# EAGLE design panstamp-ld-relay-antcenter (EAGLE 9.0.0)
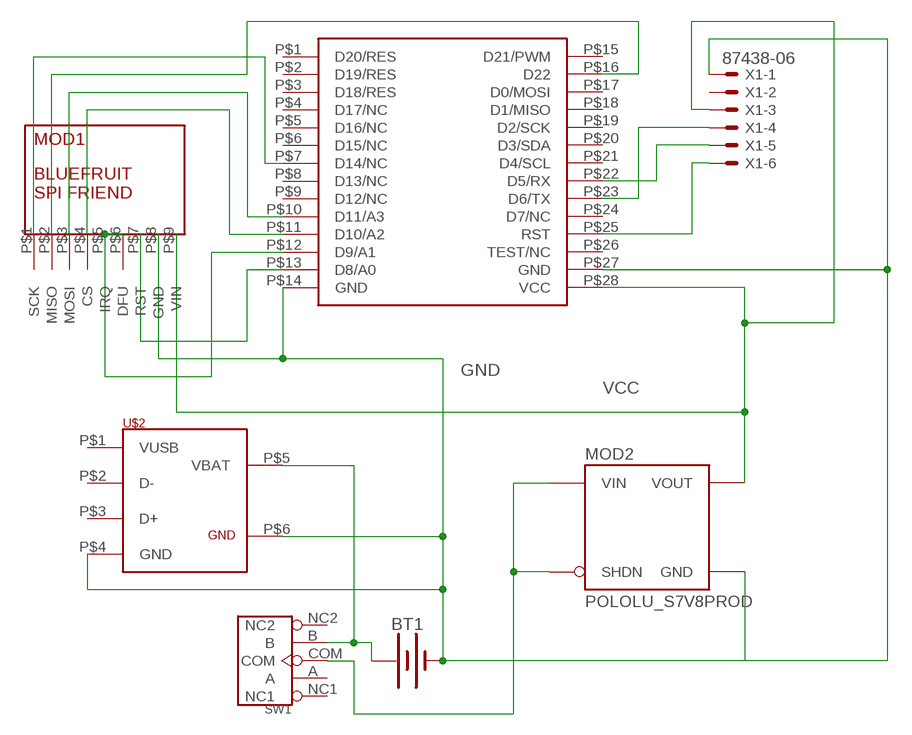
[diagram p0: schematic, sheet 1]

## Parts
BT1  BATTERY-18650  [BATTERY_18650-HOLDER]
MOD1  BLUEFRUIT-SPI  [BLUEFRUIT-SPI]
MOD2  POLOLU_S7V8PROD  [POLOLU_4P_SIGO]
SW1  DIP-TOGGLE-SWITCH-ON-ON(3+2P-8.8X4.6MM)-90D  [SW5-2.0-8.8X4.4X4.7MM-90D]
U$1  PANSTAMP-LD  [PANSTAMP-LD]
U$2  JS-1965  [JS-1965]
X1  87438-06  [87438-06]

## Nets
GND: BT1.GND@1(-) MOD1.P$8(GND) MOD2.G(GND) U$1.P$14(GND) U$1.P$27(GND) U$2.P$4(GND) U$2.P$6(GND) X1.1
N$1: U$1.P$23(D6/TX) X1.4
N$2: MOD1.P$2(MISO) U$1.P$16(D22)
N$3: MOD1.P$4(CS) U$1.P$11(D10/A2)
N$4: MOD1.P$3(MOSI) U$1.P$10(D11/A3)
N$5: MOD1.P$7(RST) U$1.P$13(D8/A0)
N$6: MOD1.P$1(SCK) U$1.P$7(D14/NC)
N$7: MOD2.I(VIN) MOD2.S(SHDN) SW1.COM
N$8: MOD1.P$5(IRQ) U$1.P$12(D9/A1)
N$9: U$1.P$22(D5/RX) X1.5
N$10: U$1.P$25(RST) X1.6
VBAT: BT1.PWR@1(+) SW1.B U$2.P$5(VBAT)
VCC: MOD1.P$9(VIN) MOD2.O(VOUT) U$1.P$28(VCC) X1.3
Unconnected: MOD1.P$6(DFU) SW1.A SW1.NC1 SW1.NC2 U$1.P$1(D20/RES) U$1.P$2(D19/RES) U$1.P$3(D18/RES) U$1.P$4(D17/NC) U$1.P$5(D16/NC) U$1.P$6(D15/NC) U$1.P$8(D13/NC) U$1.P$9(D12/NC) U$1.P$15(D21/PWM) U$1.P$17(D0/MOSI) U$1.P$18(D1/MISO) U$1.P$19(D2/SCK) U$1.P$20(D3/SDA) U$1.P$21(D4/SCL) U$1.P$24(D7/NC) U$1.P$26(TEST/NC) U$2.P$1(VUSB) U$2.P$2(D-) U$2.P$3(D+) X1.2

## Library data of the parts
BT1 = SparkFun-Batteries:BATTERY: Battery - Single Cell A variety of battery chemistries, sizes, and footprints. Device List: 20MM_PTH - Coin Cell Battery Holder - 20mm (PTH) <https://www.sparkfun.com/products/783> 6.8MM_PTH - Coin Cell Battery Holder - 6.8MM(SMD) <https://www.digikey.com/product-detail/en/seiko-instruments/MS621FE-FL11E/728-1057-ND/1889208?WT.srch=1&gclid=CNOQ5a6LzdQCFZS2wAodXCkE0g> 12MM_SMD - Coin Cell Battery Holder - 12mm (SMD) <https://www.sparkfun.com/products/10592> 12MM_PTH - Coin Cell Battery Holder - 12mm (PTH) <https://www.sparkfun.com/products/7948> 20MM_SMD - 20mm Coin Cell Battery Holder (SMD) (2 legs) Used on the Big Time Watch Kit <https://www.sparkfun.com/products/11734> 20MM_SMD_4LEGS - Coin Cell Battery Holder - 20mm (SMD) <https://www.sparkfun.com/products/11892> 20MM_SMD_4LEGS_OVERPASTE - Coin Cell Battery Holder - 20mm (SMD) <https://www.sparkfun.com/products/11892> (Over-paste on the legs) 24.5MM_PTH - Coin Cell Battery Holder - 24.5mm (PTH) <https://www.sparkfun.com/products/8863> 9V - 9V Battery Holder - PC Mount Used on the SparkFun SparkPunk Sound Kit <https://www.sparkfun.com/products/11177> and SparkFun SparkPunk Sequencer Kit <https://www.sparkfun.com/products/12707> 18650 - Battery Holder - 18650 (PTH) <https://www.sparkfun.com/products/13113> AA - Battery Holder - 1xAA (PTH) <https://www.sparkfun.com/products/7949> AAA - Battery Holder - 1xAAA (PTH) <https://www.sparkfun.com/products/12718> AA_KIT - Battery Holder - 1xAA (PTH) <https://www.sparkfun.com/products/7949> Special kit package - pads only have exposed copper on one side of the board. AAA_KIT - Battery Holder - 1xAAA (PTH) <https://www.sparkfun.com/products/12718> Special kit package - pads only have exposed copper on one side of the board.; PROD_ID: BATT-12327; SF_SKU: PRT-13113
MOD1 = relay-components:BLUEFRUIT-SPI
MOD2 = relay-components:POLOLU_S7V8: Pololu Adjustable Step Up/Down Voltage Regulators REG09B 0.4"x0.6" SOURCE www.pololu.com/ PACKAGE THT; 4-pin (0.1"); 0.4"x0.6"
SW1 = Seeed-Switch:DIP-TOGGLE-SWITCH-ON-ON(3+2P-8.8X4.6MM)-90D: 311030008; MPN: 3P-2.0-90D3P-2.0-90D-REINFORCE
U$1 = relay-components:PANSTAMP-LD: Panstamp Long Distance Board
U$2 = relay-components:JS-1965: Jaycon JS-1965 Lipo Charger with the MCP73831 charger chip.
X1 = Components:87438-06: Wire-to-Board 1.50mm (.059") Pitch Header - Right Angle, SMT, Shrouded Source: http://www.molex.com/product/micro/87438.html; MPN: 87438-0643; OC_FARNELL: 1756938; OC_NEWARK: 88K3155

## Board
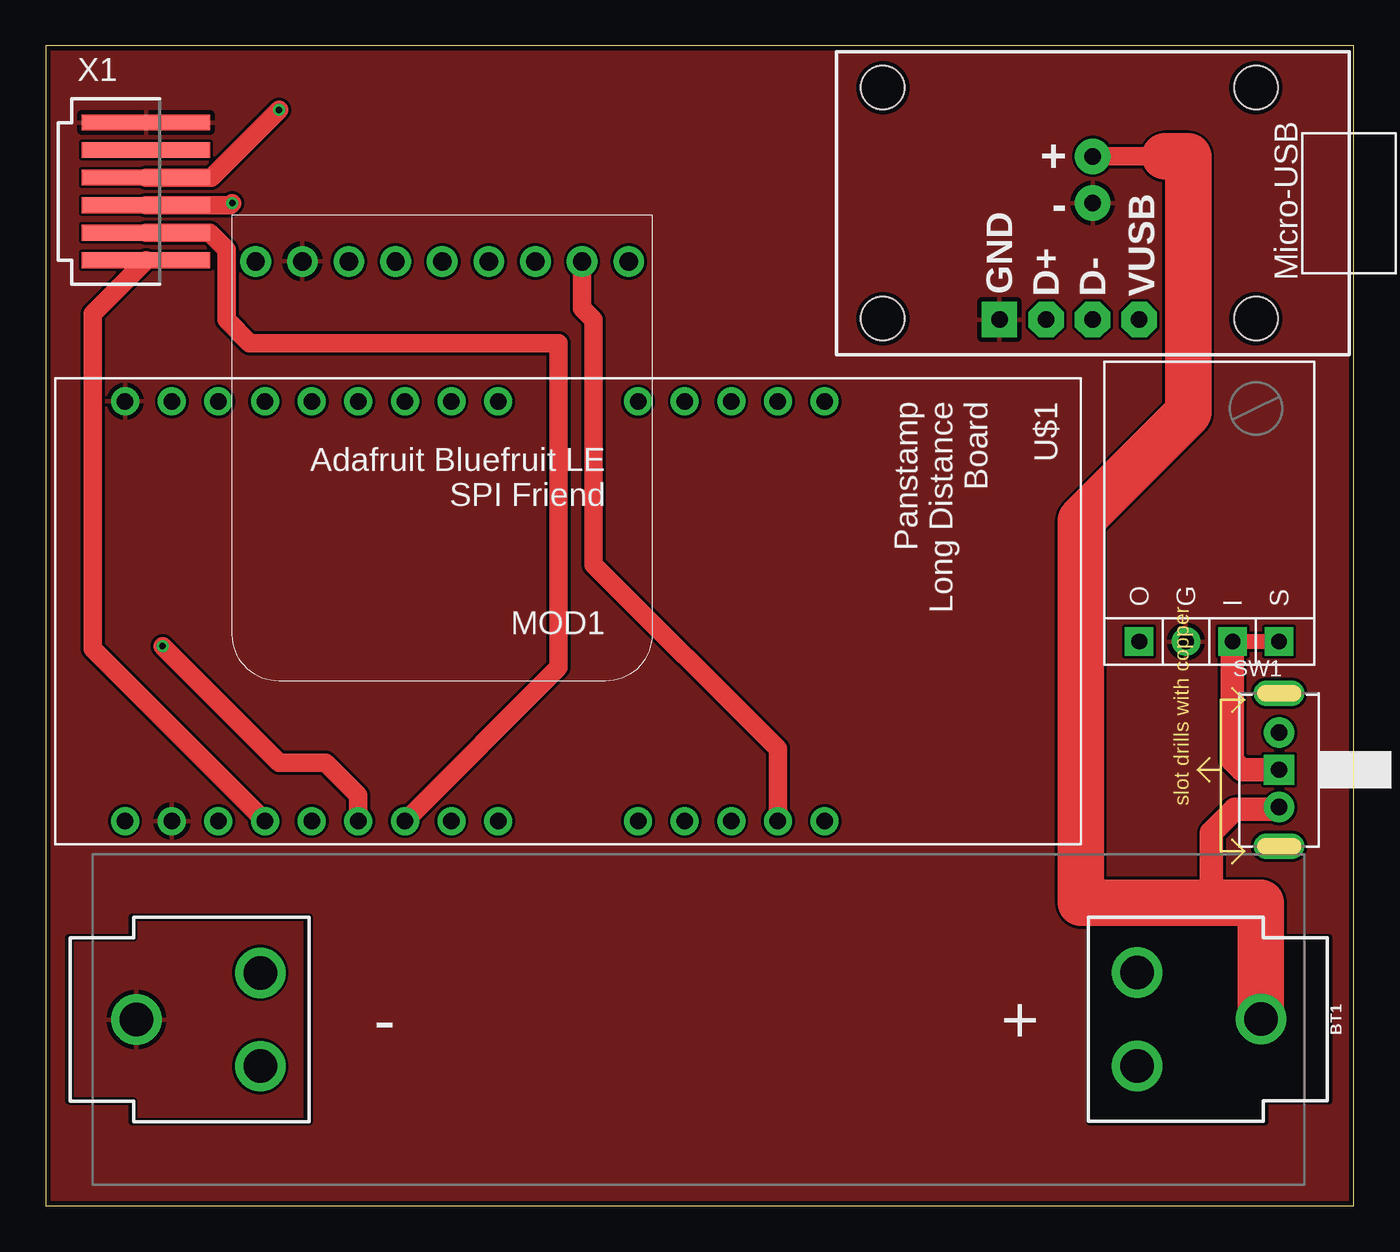
[diagram p1: board, top side]
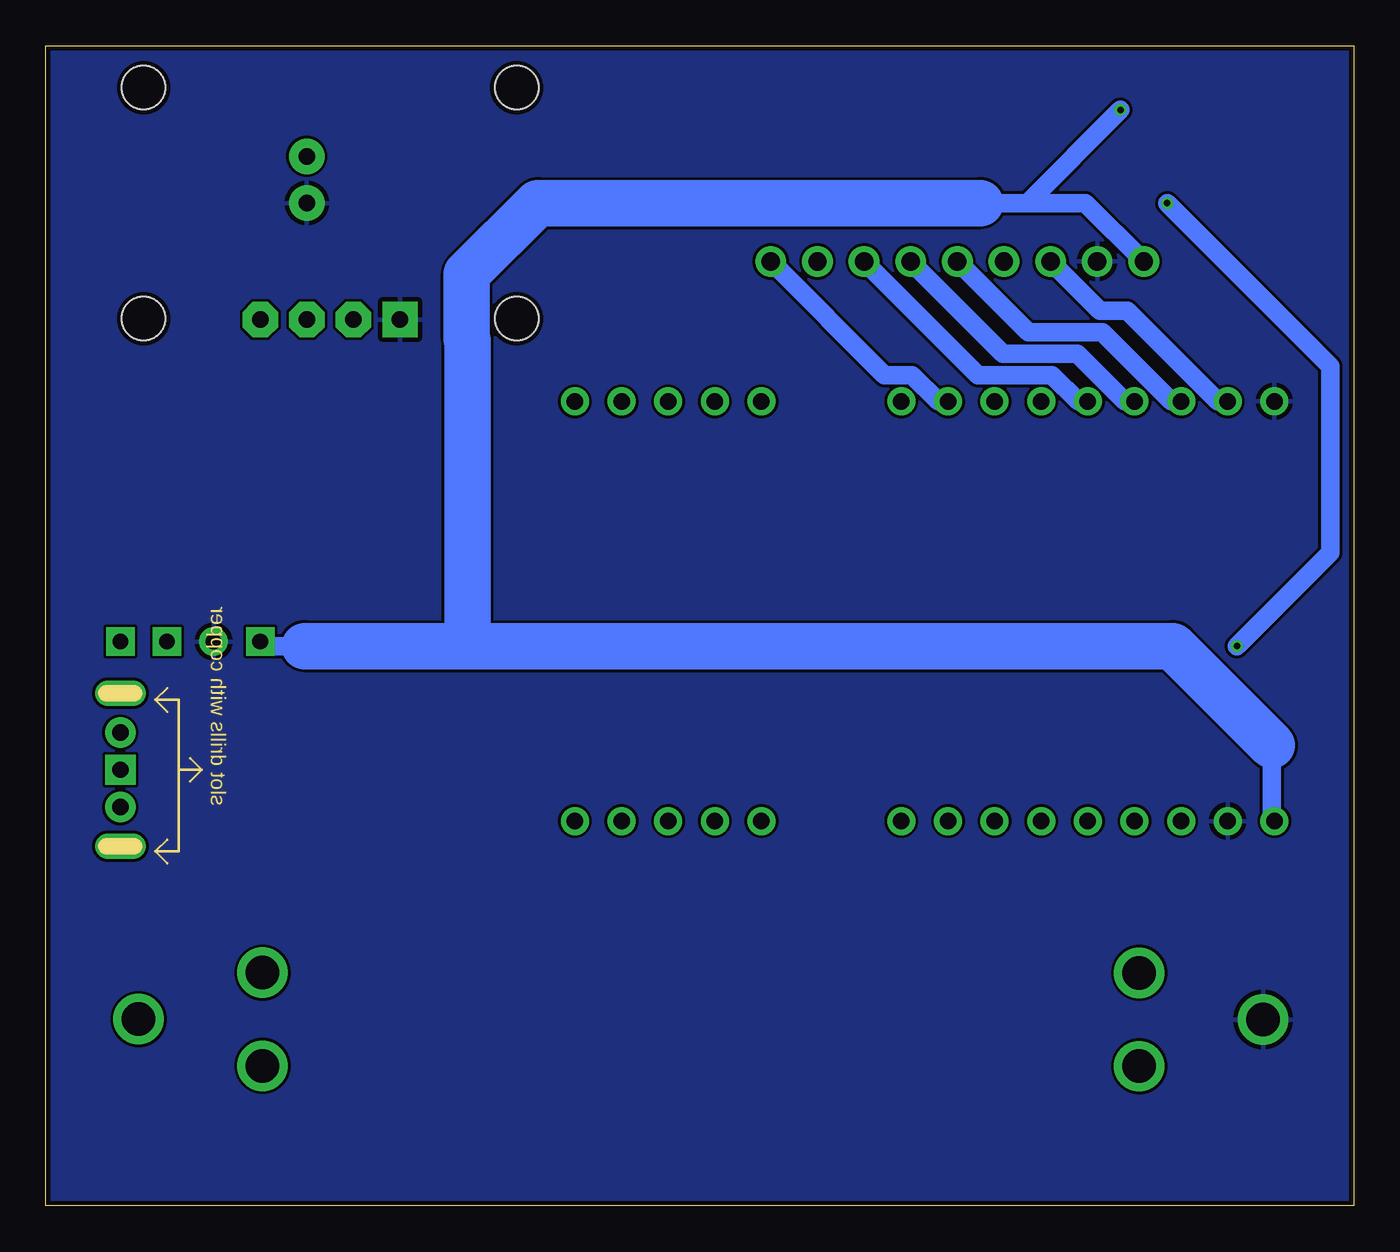
[diagram p2: board, bottom side, seen from below]

Size 71.24 x 63.17 mm. Coordinates in mm from the lower left corner, seen from the top.
Outline: 0,0 71.24,0 71.24,63.17 0,63.17 0,0
Copper layers (1*16): Top 0.035mm / dielectric 1.5mm / Bottom 0.035mm
Design rules "SeeedStudio_2layer_DRU_no_angle_20140221 *": minimum track width 8mil, minimum drill 12mil, track to track 6mil, track to pad 6mil, pad to pad 6mil, via to via 6mil, smd to smd 0mil, copper to edge 10mil, drill to drill 10mil, minimum pad ring 10mil, minimum via ring 6mil, stop-mask expansion 2mil, vias tented up to drill 100mil, thermal gap 10mil

### Footprints (pad centres in the part's own frame; a part is rotated, then mirrored left to right if it is on the bottom)
BATTERY_18650-HOLDER = drill 1.829: GND@1 30.628,0.01; GND@2 23.88,2.55; GND@3 23.88,-2.53; PWR@1 -30.628,-0.01; PWR@2 -23.88,2.53; PWR@3 -23.88,-2.55
BLUEFRUIT-SPI = drill 1 pad 1.676: P$1 1.27,2.54; P$2 3.81,2.54; P$3 6.35,2.54; P$4 8.89,2.54; P$5 11.43,2.54; P$6 13.97,2.54; P$7 16.51,2.54; P$8 19.05,2.54; P$9 21.59,2.54
POLOLU_4P_SIGO = drill 0.85 pad 1.549: G -1.27,-8.89 | drill 0.85 pad 1.549 square: I 1.27,-8.89; O -3.81,-8.89; S 3.81,-8.89
SW5-2.0-8.8X4.4X4.7MM-90D = drill 0.889 pad 1.651: A 0,2.032; B 0,-2.032 | drill 0.889 pad 1.651 square: COM 0,0 | drill 0.762 pad 1.397 long: NC1 0,4.166; NC2 0,-4.166
PANSTAMP-LD = drill 0.9 pad 1.524: P$1 2.54,43.18; P$2 2.54,40.64; P$3 2.54,38.1; P$4 2.54,35.56; P$5 2.54,33.02; P$6 2.54,25.4; P$7 2.54,22.86; P$8 2.54,20.32; P$9 2.54,17.78; P$10 2.54,15.24; P$11 2.54,12.7; P$12 2.54,10.16; P$13 2.54,7.62; P$14 2.54,5.08; P$15 25.4,43.18; P$16 25.4,40.64; P$17 25.4,38.1; P$18 25.4,35.56; P$19 25.4,33.02; P$20 25.4,25.4; P$21 25.4,22.86; P$22 25.4,20.32; P$23 25.4,17.78; P$24 25.4,15.24; P$25 25.4,12.7; P$26 25.4,10.16; P$27 25.4,7.62; P$28 25.4,5.08
JS-1965 = drill 0.9 pad 1.93 octagon: P$1 16.51,2.54; P$2 13.97,2.54; P$3 11.43,2.54 | drill 0.9 pad 1.93 square: P$4 8.89,2.54 | drill 0.9 pad 1.93: P$5 13.97,11.43; P$6 13.97,8.89 | hole 2.381: 2.54,2.603; 22.86,2.603; 22.86,15.177; 2.54,15.177
87438-06 = smd 7 x 0.85: 1 0,3.75; 2 0,2.25; 3 0,0.75; 4 0,-0.75; 5 0,-2.25; 6 0,-3.75

### Placement (x,y rotation side)
BT1  35.56,10.16 180 top
MOD1  33.02,53.98 180 top
MOD2  63.37,39.62 0 top
SW1  67.18,23.75 0 top
U$1  -0.76,46.35 270 top
U$2  43.05,45.72 0 top
X1  5.46,55.24 0 top

### Tracks (layer width: path | path; a pad name or v marks a point on that pad's centre or on a via)
GND
  pour Top (isolate 0.1): 0,63.5 72.39,63.5 72.39,0 0,0
  pour Bottom (isolate 0.1): 0,64.14 72.39,64.14 72.39,0 0,0
N$1  (via drill 0.35)
  Top 1.016: X1.4 10.04,54.49 v10.16,54.61 | v6.35,30.48 12.7,24.13 15.24,24.13 17.02,22.35 U$1.P$23
  Bottom 1.016: v10.16,54.61 1.27,45.72 1.27,35.56 v6.35,30.48
N$2
  Top 1.016: MOD1.P$2 29.21,48.9 29.84,48.26 29.84,34.92 39.88,24.89 U$1.P$16
N$3
  Bottom 1.016: MOD1.P$4 19.1,46.41 15.06,46.41 12.47,43.81 U$1.P$11
N$4
  Bottom 1.016: MOD1.P$3 20.47,45.24 16.43,45.24 15.01,43.81 U$1.P$10
N$5
  Bottom 1.016: MOD1.P$7 13.82,48.74 12.31,48.74 7.39,43.81 U$1.P$13
N$6
  Bottom 1.016: MOD1.P$1 25.55,45.24 24.05,45.24 22.63,43.81 U$1.P$7
N$7
  Top 0.813: MOD2.S MOD2.I
  Top 1.27: SW1.COM 65.15,23.75 64.64,24.26 MOD2.I
N$8
  Bottom 1.016: MOD1.P$5 17.73,47.57 13.69,47.57 9.93,43.81 U$1.P$12
N$9
  Top 1.016: X1.5 8.92,52.99 9.84,52.07 9.84,48.26 11.11,46.99 27.94,46.99 27.94,29.34 U$1.P$22
N$10
  Top 1.016: X1.6 2.54,48.57 2.54,30.35 U$1.P$25
VBAT
  Top 1.016: U$2.P$5 60.96,57.15
  Top 1.27: SW1.B 67.06,21.59 64.77,21.59 63.5,20.32 63.5,16.51
  Top 2.54: BT1.PWR@1 66.19,16.51 63.5,16.51 56.39,16.51 56.39,37.34 62.23,43.18 62.23,57.15 60.96,57.15
VCC  (via drill 0.35)
  Top 1.016: X1.3 9.01,55.99 v12.7,59.69
  Bottom 1.016: MOD2.O 59.56,30.48 57.15,30.48 55.88,30.48 | 4.45,25.08 4.45,21.08 U$1.P$28 | 17.78,54.61 14.61,54.61 MOD1.P$9 | v12.7,59.69 17.78,54.61 | 17.78,54.61 20.32,54.61
  Bottom 2.54: 57.15,30.48 48.26,30.48 | 48.26,30.48 9.84,30.48 4.45,25.08 | 48.26,30.48 48.26,47.15 48.31,47.2 48.31,50.75 44.45,54.61 20.32,54.61